# Altium schematic sheet BLE.SchDoc
size A4
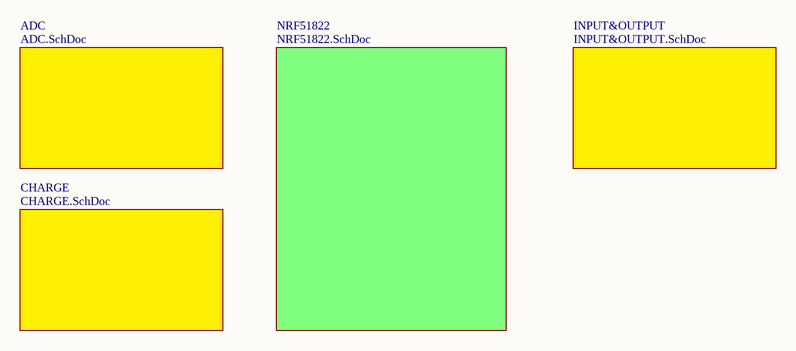
[diagram p0: BLE.SchDoc]

## Sub-sheets
ADC = ADC.SchDoc: no entries
CHARGE = CHARGE.SchDoc: no entries
INPUT&OUTPUT = INPUT&OUTPUT.SchDoc: no entries
NRF51822 = NRF51822.SchDoc: no entries